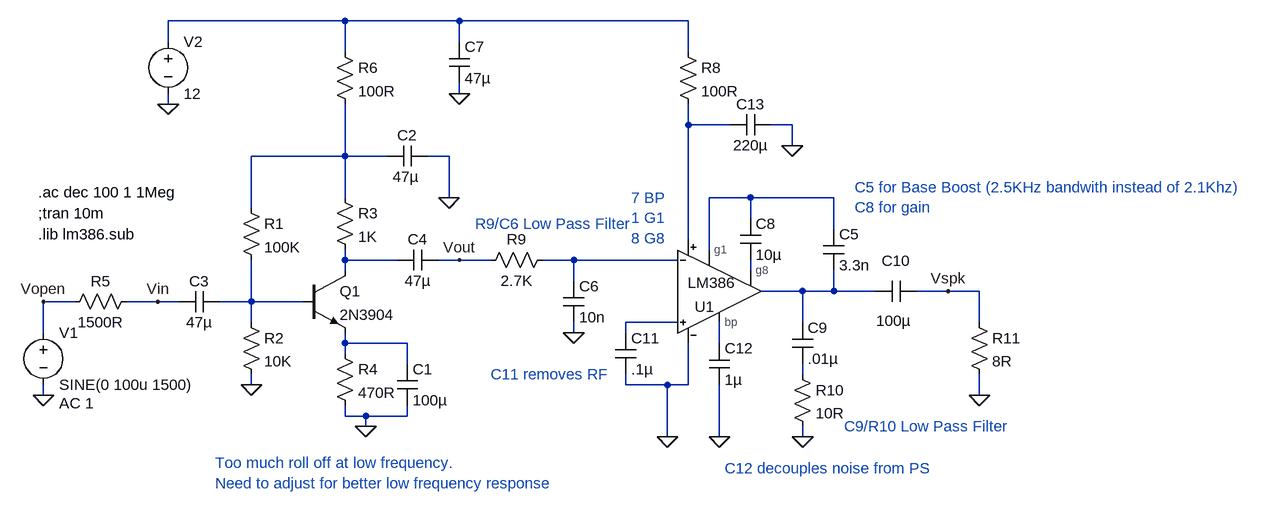
[diagram p0: schematic Complete Audio Amp.asc]
Complete Audio Amp.asc, the LTspice schematic file:
Version 4
SHEET 1 1720 680
WIRE 224 -256 -48 -256
WIRE 400 -256 224 -256
WIRE 752 -256 400 -256
WIRE -48 -224 -48 -256
WIRE 400 -224 400 -256
WIRE 224 -208 224 -256
WIRE 752 -208 752 -256
WIRE 400 -144 400 -160
WIRE -48 -128 -48 -144
WIRE 752 -96 752 -128
WIRE 816 -96 752 -96
WIRE 912 -96 880 -96
WIRE 912 -64 912 -96
WIRE 224 -48 224 -128
WIRE 224 -48 80 -48
WIRE 288 -48 224 -48
WIRE 384 -48 352 -48
WIRE 224 16 224 -48
WIRE 384 16 384 -48
WIRE 848 16 784 16
WIRE 976 16 848 16
WIRE 80 32 80 -48
WIRE 848 48 848 16
WIRE 976 64 976 16
WIRE 752 80 752 -96
WIRE 784 96 784 16
WIRE 224 112 224 96
WIRE 304 112 224 112
WIRE 400 112 368 112
WIRE 448 112 400 112
WIRE 576 112 528 112
WIRE 736 112 576 112
WIRE 224 128 224 112
WIRE 848 128 848 112
WIRE 576 144 576 112
WIRE 928 160 864 160
WIRE 976 160 976 128
WIRE 976 160 928 160
WIRE 1040 160 976 160
WIRE 1152 160 1104 160
WIRE 1200 160 1152 160
WIRE -192 176 -240 176
WIRE -64 176 -112 176
WIRE -32 176 -64 176
WIRE 80 176 80 112
WIRE 80 176 32 176
WIRE 160 176 80 176
WIRE 80 208 80 176
WIRE 736 208 656 208
WIRE 928 208 928 160
WIRE 1200 208 1200 160
WIRE -240 224 -240 176
WIRE 576 224 576 208
WIRE 656 224 656 208
WIRE 224 240 224 224
WIRE 320 240 224 240
WIRE 800 240 800 208
WIRE 224 256 224 240
WIRE 320 272 320 240
WIRE 928 288 928 272
WIRE 80 304 80 288
WIRE 656 304 656 288
WIRE 720 304 656 304
WIRE 752 304 752 240
WIRE 752 304 720 304
WIRE -240 320 -240 304
WIRE 1200 320 1200 288
WIRE 224 352 224 336
WIRE 256 352 224 352
WIRE 320 352 320 336
WIRE 320 352 256 352
WIRE 256 368 256 352
WIRE 720 384 720 304
WIRE 800 384 800 304
WIRE 928 384 928 368
FLAG -48 -128 0
FLAG -240 320 0
FLAG 80 304 0
FLAG 256 368 0
FLAG 384 16 0
FLAG -240 176 Vopen
FLAG -64 176 Vin
FLAG 400 112 Vout
FLAG 576 224 0
FLAG 400 -144 0
FLAG 720 384 0
FLAG 928 384 0
FLAG 1200 320 0
FLAG 1152 160 Vspk
FLAG 800 384 0
FLAG 912 -64 0
SYMBOL npn 160 128 R0
SYMATTR InstName Q1
SYMATTR Value 2N3904
SYMBOL res 64 16 R0
SYMATTR InstName R1
SYMATTR Value 100K
SYMBOL res 64 192 R0
SYMATTR InstName R2
SYMATTR Value 10K
SYMBOL res 208 0 R0
SYMATTR InstName R3
SYMATTR Value 1K
SYMBOL res 208 240 R0
SYMATTR InstName R4
SYMATTR Value 470R
SYMBOL cap 304 272 R0
SYMATTR InstName C1
SYMATTR Value 100µ
SYMBOL cap 352 -64 R90
WINDOW 0 0 32 VBottom 2
WINDOW 3 32 34 VTop 2
SYMATTR InstName C2
SYMATTR Value 47µ
SYMBOL cap 32 160 R90
WINDOW 0 0 32 VBottom 2
WINDOW 3 32 32 VTop 2
SYMATTR InstName C3
SYMATTR Value 47µ
SYMBOL voltage -240 208 R0
WINDOW 123 24 124 Left 2
WINDOW 39 0 0 Left 2
SYMATTR Value2 AC 1
SYMATTR InstName V1
SYMATTR Value SINE(0 100u 1500)
SYMBOL voltage -48 -240 R0
WINDOW 123 0 0 Left 2
WINDOW 39 0 0 Left 2
SYMATTR InstName V2
SYMATTR Value 12
SYMBOL res -96 160 R90
WINDOW 0 0 56 VBottom 2
WINDOW 3 32 56 VTop 2
SYMATTR InstName R5
SYMATTR Value 1500R
SYMBOL res 208 -224 R0
SYMATTR InstName R6
SYMATTR Value 100R
SYMBOL cap 368 96 R90
WINDOW 0 0 32 VBottom 2
WINDOW 3 32 32 VTop 2
SYMATTR InstName C4
SYMATTR Value 47µ
SYMBOL LM386 800 160 R0
WINDOW 3 -49 -13 Left 2
WINDOW 0 -38 24 Left 2
SYMATTR InstName U1
SYMBOL cap 560 144 R0
SYMATTR InstName C6
SYMATTR Value 10n
SYMBOL cap 384 -224 R0
SYMATTR InstName C7
SYMATTR Value 47µ
SYMBOL cap 832 48 R0
SYMATTR InstName C8
SYMATTR Value 10µ
SYMBOL res 544 96 R90
WINDOW 0 0 56 VBottom 2
WINDOW 3 32 56 VTop 2
SYMATTR InstName R9
SYMATTR Value 2.7K
SYMBOL cap 912 208 R0
SYMATTR InstName C9
SYMATTR Value .01µ
SYMBOL res 912 272 R0
SYMATTR InstName R10
SYMATTR Value 10R
SYMBOL cap 1104 144 R90
WINDOW 0 -15 32 VBottom 2
WINDOW 3 46 36 VTop 2
SYMATTR InstName C10
SYMATTR Value 100µ
SYMBOL res 1184 192 R0
SYMATTR InstName R11
SYMATTR Value 8R
SYMBOL cap 640 224 R0
SYMATTR InstName C11
SYMATTR Value .1µ
SYMBOL cap 784 240 R0
SYMATTR InstName C12
SYMATTR Value 1µ
SYMBOL cap 880 -112 R90
WINDOW 0 0 32 VBottom 2
WINDOW 3 32 32 VTop 2
SYMATTR InstName C13
SYMATTR Value 220µ
SYMBOL res 736 -224 R0
SYMATTR InstName R8
SYMATTR Value 100R
SYMBOL cap 960 64 R0
SYMATTR InstName C5
SYMATTR Value 3.3n
TEXT -248 40 Left 2 !;tran 10m
TEXT -248 72 Left 2 !.lib lm386.sub
TEXT 664 16 Left 2 ;7 BP\n1 G1\n8 G8
TEXT -248 8 Left 2 !.ac dec 100 1 1Meg
TEXT 24 424 Left 2 ;Too much roll off at low frequency.  \nNeed to adjust for better low frequency response
TEXT 1008 0 Left 2 ;C5 for Base Boost (2.5KHz bandwith instead of 2.1Khz)\nC8 for gain
TEXT 448 288 Left 2 ;C11 removes RF
TEXT 808 432 Left 2 ;C12 decouples noise from PS
TEXT 992 368 Left 2 ;C9/R10 Low Pass Filter
TEXT 424 56 Left 2 ;R9/C6 Low Pass Filter

The netlist it stands for:
* Complete Audio Amp.asc
Q1 N005 N009 N011 0 2N3904
R1 N003 N009 100K
R2 N009 0 10K
R3 N003 N005 1K
R4 N011 0 470R
C1 N011 0 100µ
C2 0 N003 47µ
C3 N009 Vin 47µ
V1 Vopen 0 SINE(0 100u 1500) AC 1
V2 N001 0 12
R5 Vin Vopen 1500R
R6 N001 N003 100R
C4 Vout N005 47µ
XU1 N004 N006 N010 0 N008 N002 N012 N007 LM386 LM386  ; pins g1 In- In+ V- OUT V+ bp g8
C6 N006 0 10n
C7 N001 0 47µ
C8 N004 N007 10µ
R9 N006 Vout 2.7K
C9 N008 N013 .01µ
R10 N013 0 10R
C10 Vspk N008 100µ
R11 Vspk 0 8R
C11 N010 0 .1µ
C12 N012 0 1µ
C13 0 N002 220µ
R8 N001 N002 100R
C5 N004 N008 3.3n
.model NPN NPN
.model PNP PNP
.lib standard.bjt
;tran 10m
.lib lm386.sub
* 7 BP
* 1 G1
* 8 G8
.ac dec 100 1 1Meg
* Too much roll off at low frequency.
* Need to adjust for better low frequency response
* C5 for Base Boost (2.5KHz bandwith instead of 2.1Khz)
* C8 for gain
* C11 removes RF
* C12 decouples noise from PS
* C9/R10 Low Pass Filter
* R9/C6 Low Pass Filter
.lib LM386.sub
.backanno
.end